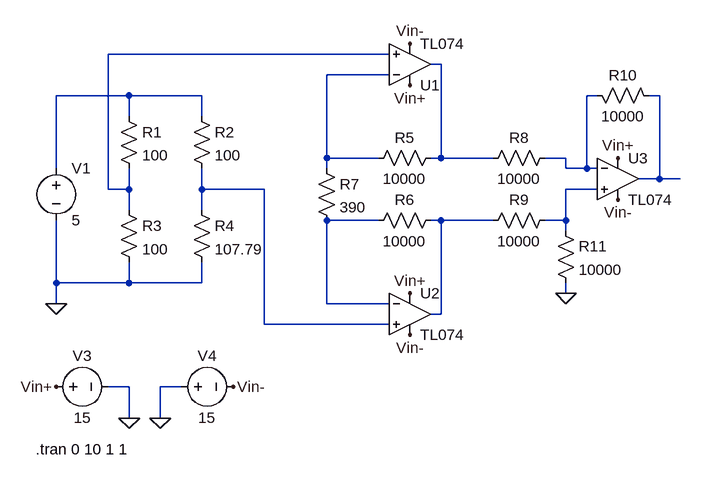
[diagram p0: schematic instrumentation_amplifier.asc]
instrumentation_amplifier.asc, the LTspice schematic file:
Version 4
SHEET 1 1092 680
WIRE 624 -64 192 -64
WIRE 704 -48 688 -48
WIRE 624 -32 528 -32
WIRE 224 0 112 0
WIRE 336 0 224 0
WIRE 944 0 928 0
WIRE 1040 0 1024 0
WIRE 224 32 224 0
WIRE 336 32 336 0
WIRE 528 96 528 -32
WIRE 608 96 528 96
WIRE 704 96 704 -48
WIRE 704 96 688 96
WIRE 784 96 704 96
WIRE 896 96 864 96
WIRE 112 112 112 0
WIRE 528 112 528 96
WIRE 896 112 896 96
WIRE 928 112 928 0
WIRE 928 112 896 112
WIRE 944 112 928 112
WIRE 1040 128 1040 0
WIRE 1040 128 1008 128
WIRE 1072 128 1040 128
WIRE 192 144 192 -64
WIRE 224 144 224 112
WIRE 224 144 192 144
WIRE 336 144 336 112
WIRE 432 144 336 144
WIRE 944 144 896 144
WIRE 224 176 224 144
WIRE 336 176 336 144
WIRE 608 192 528 192
WIRE 704 192 688 192
WIRE 784 192 704 192
WIRE 896 192 896 144
WIRE 896 192 864 192
WIRE 896 208 896 192
WIRE 112 288 112 192
WIRE 224 288 224 256
WIRE 224 288 112 288
WIRE 336 288 336 256
WIRE 336 288 224 288
WIRE 896 304 896 288
WIRE 112 320 112 288
WIRE 528 320 528 192
WIRE 624 320 528 320
WIRE 704 336 704 192
WIRE 704 336 688 336
WIRE 432 352 432 144
WIRE 624 352 432 352
WIRE 224 448 192 448
WIRE 304 448 272 448
WIRE 224 496 224 448
WIRE 272 496 272 448
FLAG 112 320 0
FLAG 224 496 0
FLAG 272 496 0
FLAG 112 448 Vin+
FLAG 656 304 Vin+
FLAG 656 -16 Vin+
FLAG 976 96 Vin+
FLAG 384 448 Vin-
FLAG 656 368 Vin-
FLAG 976 160 Vin-
FLAG 656 -80 Vin-
FLAG 896 304 0
SYMBOL voltage 112 96 R0
SYMATTR InstName V1
SYMATTR Value 5
SYMBOL res 208 16 R0
SYMATTR InstName R1
SYMATTR Value 100
SYMBOL res 320 16 R0
SYMATTR InstName R2
SYMATTR Value 100
SYMBOL res 208 160 R0
SYMATTR InstName R3
SYMATTR Value 100
SYMBOL res 320 160 R0
SYMATTR InstName R4
SYMATTR Value 107.79
SYMBOL Opamps\\TL074 656 16 M180
SYMATTR InstName U1
SYMBOL Opamps\\TL074 656 272 R0
SYMATTR InstName U2
SYMBOL Opamps\\TL074 976 64 R0
SYMATTR InstName U3
SYMBOL voltage 96 448 R270
WINDOW 0 32 56 VTop 2
WINDOW 3 -32 56 VBottom 2
SYMATTR InstName V3
SYMATTR Value 15
SYMBOL voltage 288 448 R270
WINDOW 0 32 56 VTop 2
WINDOW 3 -32 56 VBottom 2
SYMATTR InstName V4
SYMATTR Value 15
SYMBOL res 704 80 R90
WINDOW 0 0 56 VBottom 2
WINDOW 3 32 56 VTop 2
SYMATTR InstName R5
SYMATTR Value 10000
SYMBOL res 704 176 R90
WINDOW 0 0 56 VBottom 2
WINDOW 3 32 56 VTop 2
SYMATTR InstName R6
SYMATTR Value 10000
SYMBOL res 512 96 R0
SYMATTR InstName R7
SYMATTR Value 390
SYMBOL res 880 80 R90
WINDOW 0 0 56 VBottom 2
WINDOW 3 32 56 VTop 2
SYMATTR InstName R8
SYMATTR Value 10000
SYMBOL res 880 176 R90
WINDOW 0 0 56 VBottom 2
WINDOW 3 32 56 VTop 2
SYMATTR InstName R9
SYMATTR Value 10000
SYMBOL res 1040 16 M270
WINDOW 0 32 56 VTop 2
WINDOW 3 0 56 VBottom 2
SYMATTR InstName R10
SYMATTR Value 10000
SYMBOL res 880 192 R0
SYMATTR InstName R11
SYMATTR Value 10000
TEXT 80 544 Left 2 !.tran 0 10 1 1

The netlist it stands for:
* instrumentation_amplifier.asc
V1 N004 0 5
R1 N004 N001 100
R2 N004 N007 100
R3 N001 0 100
R4 N007 0 107.79
XU1 N001 N003 Vin+ Vin- N002 TL074  ; pins In+ In- V+ V- OUT
XU2 N007 N009 Vin+ Vin- N010 TL074  ; pins In+ In- V+ V- OUT
XU3 N008 N005 Vin+ Vin- N006 TL074  ; pins In+ In- V+ V- OUT
V3 Vin+ 0 15
V4 0 Vin- 15
R5 N002 N003 10000
R6 N010 N009 10000
R7 N003 N009 390
R8 N005 N002 10000
R9 N008 N010 10000
R10 N006 N005 10000
R11 N008 0 10000
.tran 0 10 1 1
.backanno
.end